# Altium project mantarray_beta2_sensor.PrjPcb
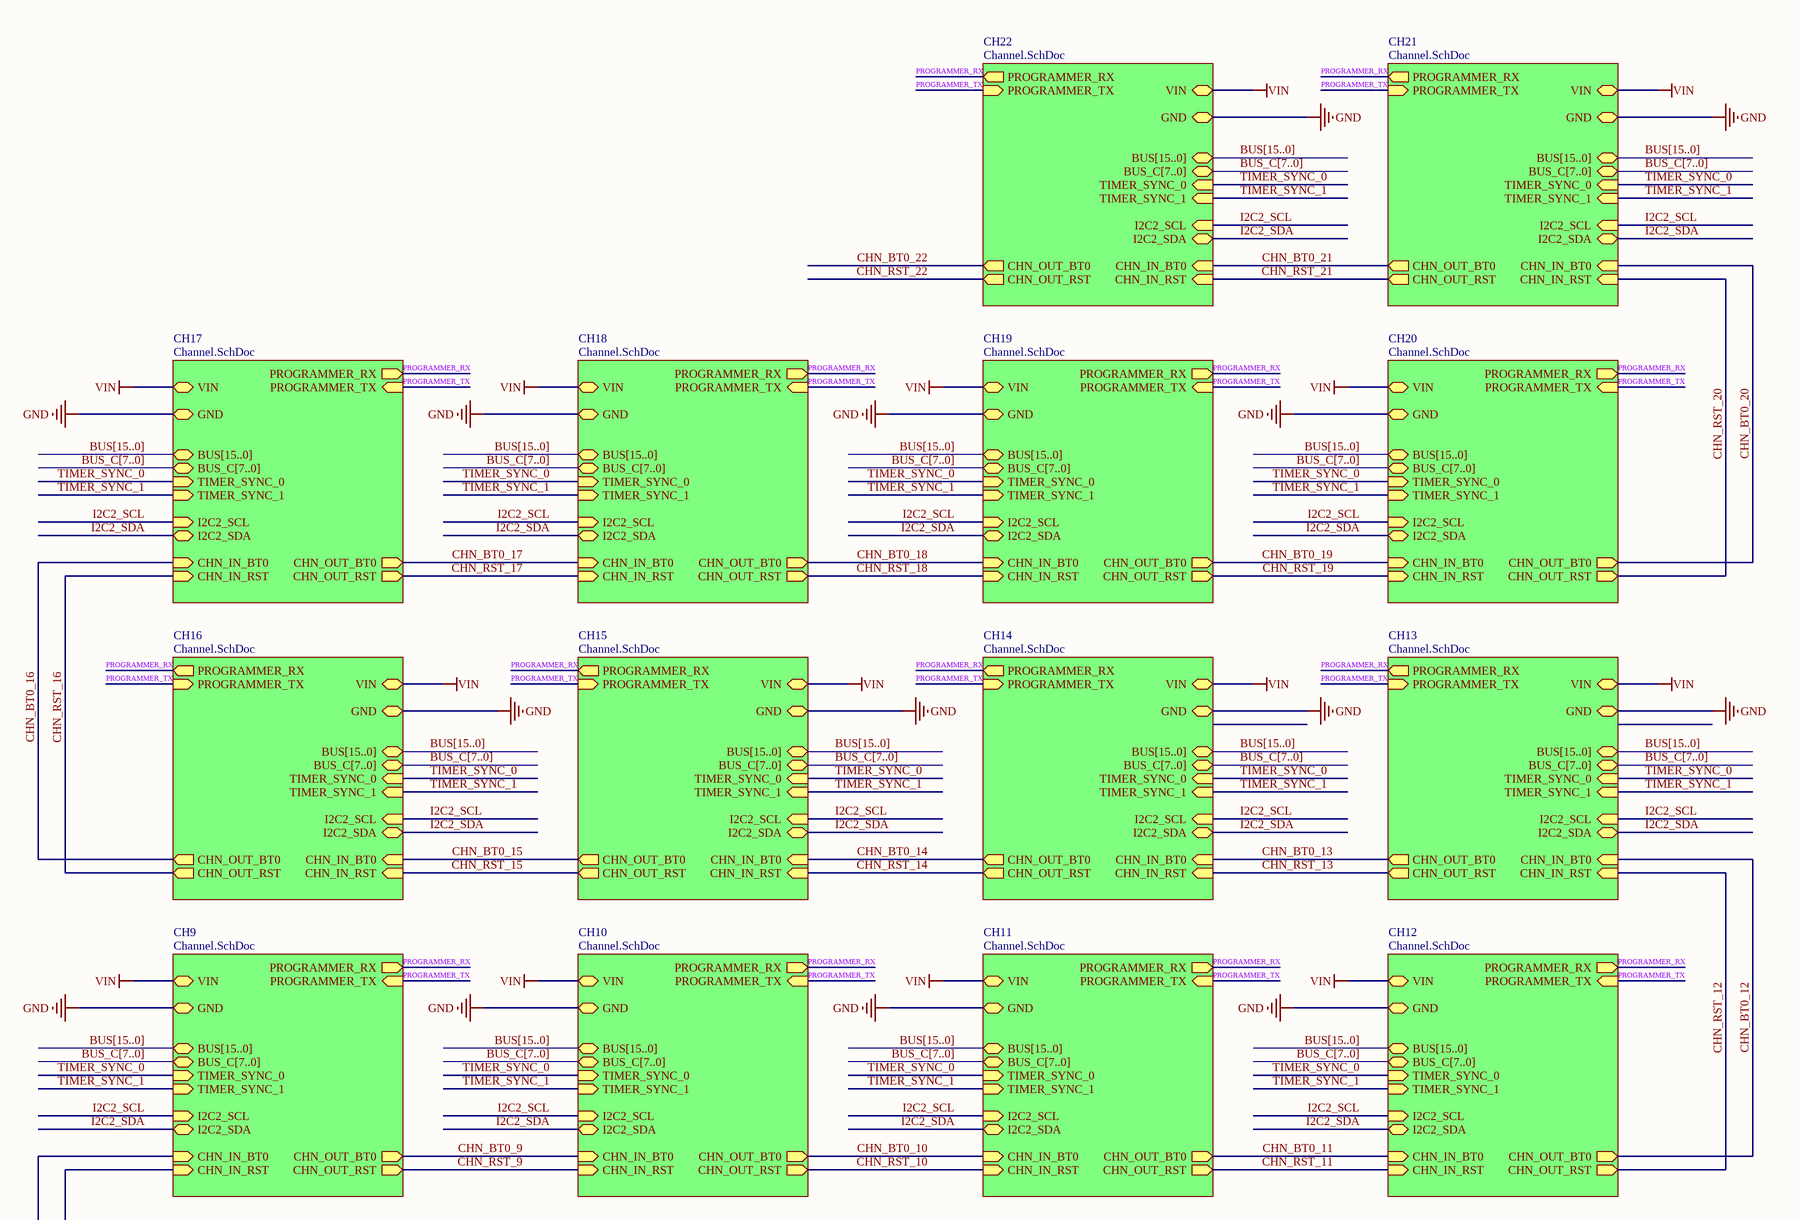
[diagram p0: mantarray_beta2_sensor.SchDoc, top right]
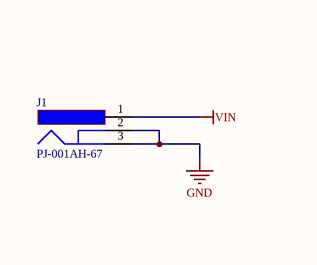
[diagram p1: mantarray_beta2_sensor.SchDoc, bottom left]
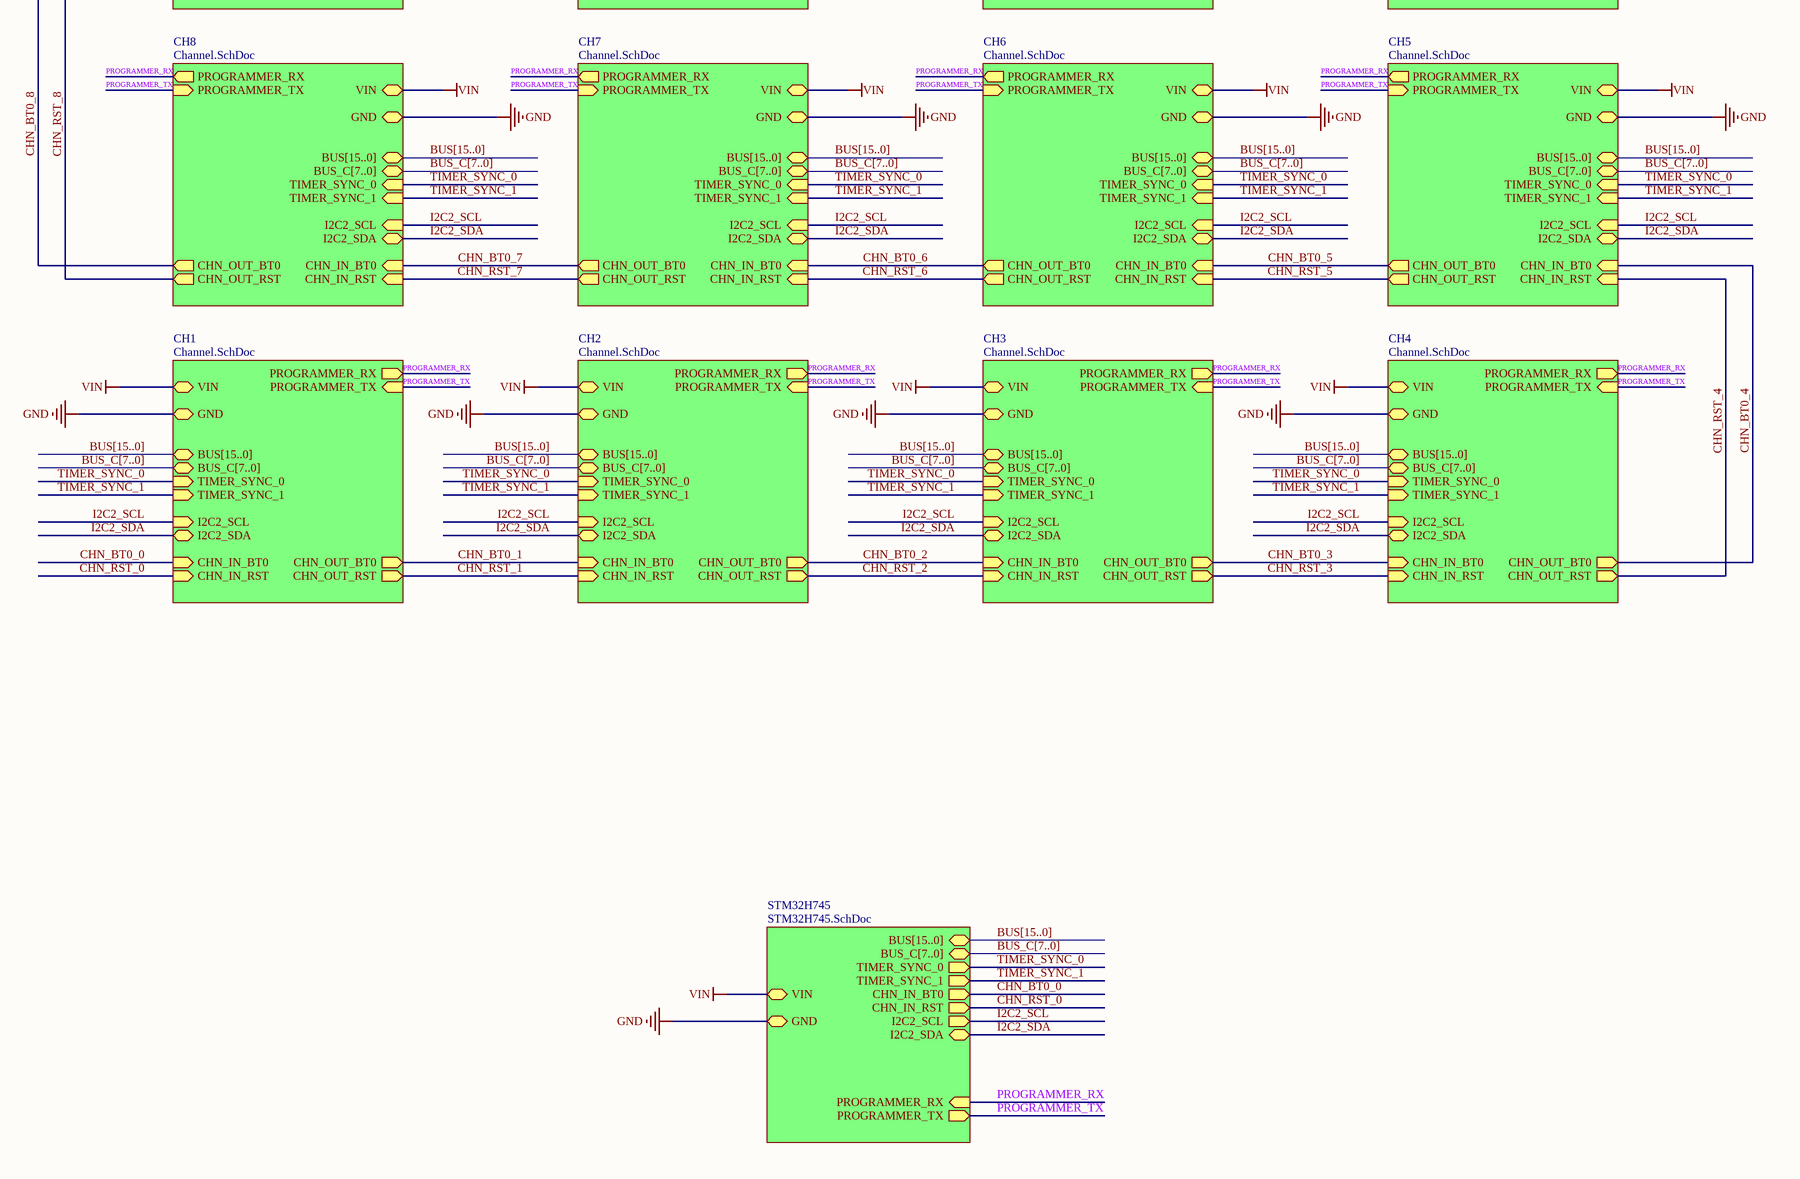
[diagram p2: mantarray_beta2_sensor.SchDoc, bottom right]
3 sheets, 47 parts. Net scope: hierarchical (ports join the sheet entries above them; power ports are global).
Board file: mantarray_beta2_sensor_arrayed.PcbDoc
Sheets:
  mantarray_beta2_sensor.SchDoc
    STM32H745 = STM32H745.SchDoc
    CH1 = Channel.SchDoc
    CH2 = Channel.SchDoc
    CH3 = Channel.SchDoc
    CH4 = Channel.SchDoc
    CH5 = Channel.SchDoc
    CH6 = Channel.SchDoc
    CH7 = Channel.SchDoc
    CH8 = Channel.SchDoc
    CH9 = Channel.SchDoc
    CH10 = Channel.SchDoc
    CH11 = Channel.SchDoc
    CH12 = Channel.SchDoc
    CH13 = Channel.SchDoc
    CH14 = Channel.SchDoc
    CH15 = Channel.SchDoc
    CH16 = Channel.SchDoc
    CH17 = Channel.SchDoc
    CH18 = Channel.SchDoc
    CH19 = Channel.SchDoc
    CH20 = Channel.SchDoc
    CH21 = Channel.SchDoc
    CH22 = Channel.SchDoc

## Sheet mantarray_beta2_sensor.SchDoc
size A1

### Parts
J1  PJ-001AH-67  [PJ-001AH-67]

### Sub-sheets
CH1 = Channel.SchDoc: GND (bidir), BUS[15..0] (bidir), CHN_OUT_BT0 (out), CHN_OUT_RST (out), BUS_C[7..0] (bidir), CHN_IN_RST (in), TIMER_SYNC_0 (in), CHN_IN_BT0 (in), TIMER_SYNC_1 (in), I2C2_SCL (in), I2C2_SDA (bidir), PROGRAMMER_RX (out), PROGRAMMER_TX (in), VIN (bidir)
CH2 = Channel.SchDoc: GND (bidir), BUS[15..0] (bidir), CHN_OUT_BT0 (out), CHN_OUT_RST (out), BUS_C[7..0] (bidir), CHN_IN_RST (in), TIMER_SYNC_0 (in), CHN_IN_BT0 (in), TIMER_SYNC_1 (in), I2C2_SCL (in), I2C2_SDA (bidir), PROGRAMMER_RX (out), PROGRAMMER_TX (in), VIN (bidir)
CH3 = Channel.SchDoc: GND (bidir), BUS[15..0] (bidir), CHN_OUT_BT0 (out), CHN_OUT_RST (out), BUS_C[7..0] (bidir), CHN_IN_RST (in), TIMER_SYNC_0 (in), CHN_IN_BT0 (in), TIMER_SYNC_1 (in), I2C2_SCL (in), I2C2_SDA (bidir), PROGRAMMER_RX (out), PROGRAMMER_TX (in), VIN (bidir)
CH4 = Channel.SchDoc: GND (bidir), BUS[15..0] (bidir), CHN_OUT_BT0 (out), CHN_OUT_RST (out), BUS_C[7..0] (bidir), CHN_IN_RST (in), TIMER_SYNC_0 (in), CHN_IN_BT0 (in), TIMER_SYNC_1 (in), I2C2_SCL (in), I2C2_SDA (bidir), PROGRAMMER_RX (out), PROGRAMMER_TX (in), VIN (bidir)
CH5 = Channel.SchDoc: GND (bidir), BUS[15..0] (bidir), CHN_OUT_BT0 (out), CHN_OUT_RST (out), BUS_C[7..0] (bidir), CHN_IN_RST (in), TIMER_SYNC_0 (in), CHN_IN_BT0 (in), TIMER_SYNC_1 (in), I2C2_SCL (in), I2C2_SDA (bidir), PROGRAMMER_TX (in), PROGRAMMER_RX (out), VIN (bidir)
CH6 = Channel.SchDoc: GND (bidir), BUS[15..0] (bidir), CHN_OUT_BT0 (out), CHN_OUT_RST (out), BUS_C[7..0] (bidir), CHN_IN_RST (in), TIMER_SYNC_0 (in), CHN_IN_BT0 (in), TIMER_SYNC_1 (in), I2C2_SCL (in), I2C2_SDA (bidir), PROGRAMMER_RX (out), PROGRAMMER_TX (in), VIN (bidir)
CH7 = Channel.SchDoc: GND (bidir), BUS[15..0] (bidir), CHN_OUT_BT0 (out), CHN_OUT_RST (out), BUS_C[7..0] (bidir), CHN_IN_RST (in), TIMER_SYNC_0 (in), CHN_IN_BT0 (in), TIMER_SYNC_1 (in), I2C2_SCL (in), I2C2_SDA (bidir), PROGRAMMER_RX (out), PROGRAMMER_TX (in), VIN (bidir)
CH8 = Channel.SchDoc: GND (bidir), BUS[15..0] (bidir), CHN_OUT_BT0 (out), CHN_OUT_RST (out), BUS_C[7..0] (bidir), CHN_IN_RST (in), TIMER_SYNC_0 (in), CHN_IN_BT0 (in), TIMER_SYNC_1 (in), I2C2_SCL (in), I2C2_SDA (bidir), PROGRAMMER_RX (out), PROGRAMMER_TX (in), VIN (bidir)
CH9 = Channel.SchDoc: GND (bidir), BUS[15..0] (bidir), CHN_OUT_BT0 (out), CHN_OUT_RST (out), BUS_C[7..0] (bidir), CHN_IN_RST (in), TIMER_SYNC_0 (in), CHN_IN_BT0 (in), TIMER_SYNC_1 (in), I2C2_SCL (in), I2C2_SDA (bidir), PROGRAMMER_RX (out), PROGRAMMER_TX (in), VIN (bidir)
CH10 = Channel.SchDoc: GND (bidir), BUS[15..0] (bidir), CHN_OUT_BT0 (out), CHN_OUT_RST (out), BUS_C[7..0] (bidir), CHN_IN_RST (in), TIMER_SYNC_0 (in), CHN_IN_BT0 (in), TIMER_SYNC_1 (in), I2C2_SCL (in), I2C2_SDA (bidir), PROGRAMMER_TX (in), PROGRAMMER_RX (out), VIN (bidir)
CH11 = Channel.SchDoc: GND (bidir), BUS[15..0] (bidir), CHN_OUT_BT0 (out), CHN_OUT_RST (out), BUS_C[7..0] (bidir), CHN_IN_RST (in), TIMER_SYNC_0 (in), CHN_IN_BT0 (in), TIMER_SYNC_1 (in), I2C2_SCL (in), I2C2_SDA (bidir), PROGRAMMER_RX (out), PROGRAMMER_TX (in), VIN (bidir)
CH12 = Channel.SchDoc: GND (bidir), BUS[15..0] (bidir), CHN_OUT_BT0 (out), CHN_OUT_RST (out), BUS_C[7..0] (bidir), CHN_IN_RST (in), TIMER_SYNC_0 (in), CHN_IN_BT0 (in), TIMER_SYNC_1 (in), I2C2_SCL (in), I2C2_SDA (bidir), PROGRAMMER_TX (in), PROGRAMMER_RX (out), VIN (bidir)
CH13 = Channel.SchDoc: GND (bidir), BUS[15..0] (bidir), CHN_OUT_BT0 (out), CHN_OUT_RST (out), BUS_C[7..0] (bidir), CHN_IN_RST (in), TIMER_SYNC_0 (in), CHN_IN_BT0 (in), TIMER_SYNC_1 (in), I2C2_SCL (in), I2C2_SDA (bidir), PROGRAMMER_RX (out), PROGRAMMER_TX (in), VIN (bidir)
CH14 = Channel.SchDoc: GND (bidir), BUS[15..0] (bidir), CHN_OUT_BT0 (out), CHN_OUT_RST (out), BUS_C[7..0] (bidir), CHN_IN_RST (in), TIMER_SYNC_0 (in), CHN_IN_BT0 (in), TIMER_SYNC_1 (in), I2C2_SCL (in), I2C2_SDA (bidir), PROGRAMMER_RX (out), PROGRAMMER_TX (in), VIN (bidir)
CH15 = Channel.SchDoc: GND (bidir), BUS[15..0] (bidir), CHN_OUT_BT0 (out), CHN_OUT_RST (out), BUS_C[7..0] (bidir), CHN_IN_RST (in), TIMER_SYNC_0 (in), CHN_IN_BT0 (in), TIMER_SYNC_1 (in), I2C2_SCL (in), I2C2_SDA (bidir), PROGRAMMER_RX (out), PROGRAMMER_TX (in), VIN (bidir)
CH16 = Channel.SchDoc: GND (bidir), BUS[15..0] (bidir), CHN_OUT_BT0 (out), CHN_OUT_RST (out), BUS_C[7..0] (bidir), CHN_IN_RST (in), TIMER_SYNC_0 (in), CHN_IN_BT0 (in), TIMER_SYNC_1 (in), I2C2_SCL (in), I2C2_SDA (bidir), PROGRAMMER_TX (in), PROGRAMMER_RX (out), VIN (bidir)
CH17 = Channel.SchDoc: GND (bidir), BUS[15..0] (bidir), CHN_OUT_BT0 (out), CHN_OUT_RST (out), BUS_C[7..0] (bidir), CHN_IN_RST (in), TIMER_SYNC_0 (in), CHN_IN_BT0 (in), TIMER_SYNC_1 (in), I2C2_SCL (in), I2C2_SDA (bidir), PROGRAMMER_TX (in), PROGRAMMER_RX (out), VIN (bidir)
CH18 = Channel.SchDoc: GND (bidir), BUS[15..0] (bidir), CHN_OUT_BT0 (out), CHN_OUT_RST (out), BUS_C[7..0] (bidir), CHN_IN_RST (in), TIMER_SYNC_0 (in), CHN_IN_BT0 (in), TIMER_SYNC_1 (in), I2C2_SCL (in), I2C2_SDA (bidir), PROGRAMMER_RX (out), PROGRAMMER_TX (in), VIN (bidir)
CH19 = Channel.SchDoc: GND (bidir), BUS[15..0] (bidir), CHN_OUT_BT0 (out), CHN_OUT_RST (out), BUS_C[7..0] (bidir), CHN_IN_RST (in), TIMER_SYNC_0 (in), CHN_IN_BT0 (in), TIMER_SYNC_1 (in), I2C2_SCL (in), I2C2_SDA (bidir), PROGRAMMER_TX (in), PROGRAMMER_RX (out), VIN (bidir)
CH20 = Channel.SchDoc: GND (bidir), BUS[15..0] (bidir), CHN_OUT_BT0 (out), CHN_OUT_RST (out), BUS_C[7..0] (bidir), CHN_IN_RST (in), TIMER_SYNC_0 (in), CHN_IN_BT0 (in), TIMER_SYNC_1 (in), I2C2_SCL (in), I2C2_SDA (bidir), PROGRAMMER_RX (out), PROGRAMMER_TX (in), VIN (bidir)
CH21 = Channel.SchDoc: GND (bidir), BUS[15..0] (bidir), CHN_OUT_BT0 (out), CHN_OUT_RST (out), BUS_C[7..0] (bidir), CHN_IN_RST (in), TIMER_SYNC_0 (in), CHN_IN_BT0 (in), TIMER_SYNC_1 (in), I2C2_SCL (in), I2C2_SDA (bidir), PROGRAMMER_TX (in), PROGRAMMER_RX (out), VIN (bidir)
CH22 = Channel.SchDoc: GND (bidir), BUS[15..0] (bidir), CHN_OUT_BT0 (out), CHN_OUT_RST (out), BUS_C[7..0] (bidir), CHN_IN_RST (in), TIMER_SYNC_0 (in), CHN_IN_BT0 (in), TIMER_SYNC_1 (in), I2C2_SCL (in), I2C2_SDA (bidir), PROGRAMMER_TX (in), PROGRAMMER_RX (out), VIN (bidir)
STM32H745 = STM32H745.SchDoc: GND (bidir), VIN (bidir), BUS[15..0] (bidir), BUS_C[7..0] (bidir), TIMER_SYNC_0 (out), I2C2_SDA (bidir), I2C2_SCL (out), TIMER_SYNC_1 (out), CHN_IN_BT0 (out), CHN_IN_RST (out), PROGRAMMER_RX (in), PROGRAMMER_TX (out)

### Nets
GND: J1.2 J1.3 ; sheet STM32H745/GND, sheet CH1/GND, sheet CH2/GND, sheet CH3/GND, sheet CH4/GND, sheet CH5/GND, sheet CH6/GND, sheet CH7/GND, sheet CH8/GND, sheet CH9/GND, sheet CH10/GND, sheet CH11/GND, sheet CH12/GND, sheet CH13/GND, sheet CH14/GND, sheet CH15/GND, sheet CH16/GND, sheet CH17/GND, sheet CH18/GND, sheet CH19/GND, sheet CH20/GND, sheet CH21/GND, sheet CH22/GND
VIN: J1.1 ; sheet STM32H745/VIN, sheet CH1/VIN, sheet CH2/VIN, sheet CH3/VIN, sheet CH4/VIN, sheet CH5/VIN, sheet CH6/VIN, sheet CH7/VIN, sheet CH8/VIN, sheet CH9/VIN, sheet CH10/VIN, sheet CH11/VIN, sheet CH12/VIN, sheet CH13/VIN, sheet CH14/VIN, sheet CH15/VIN, sheet CH16/VIN, sheet CH17/VIN, sheet CH18/VIN, sheet CH19/VIN, sheet CH20/VIN, sheet CH21/VIN, sheet CH22/VIN
CHN_BT0_0: sheet STM32H745/CHN_IN_BT0, sheet CH1/CHN_IN_BT0
CHN_BT0_1: sheet CH1/CHN_OUT_BT0, sheet CH2/CHN_IN_BT0
CHN_BT0_2: sheet CH2/CHN_OUT_BT0, sheet CH3/CHN_IN_BT0
CHN_BT0_3: sheet CH3/CHN_OUT_BT0, sheet CH4/CHN_IN_BT0
CHN_BT0_4: sheet CH4/CHN_OUT_BT0, sheet CH5/CHN_IN_BT0
CHN_BT0_5: sheet CH5/CHN_OUT_BT0, sheet CH6/CHN_IN_BT0
CHN_BT0_6: sheet CH6/CHN_OUT_BT0, sheet CH7/CHN_IN_BT0
CHN_BT0_7: sheet CH7/CHN_OUT_BT0, sheet CH8/CHN_IN_BT0
CHN_BT0_8: sheet CH8/CHN_OUT_BT0, sheet CH9/CHN_IN_BT0
CHN_BT0_9: sheet CH9/CHN_OUT_BT0, sheet CH10/CHN_IN_BT0
CHN_BT0_10: sheet CH10/CHN_OUT_BT0, sheet CH11/CHN_IN_BT0
CHN_BT0_11: sheet CH11/CHN_OUT_BT0, sheet CH12/CHN_IN_BT0
CHN_BT0_12: sheet CH12/CHN_OUT_BT0, sheet CH13/CHN_IN_BT0
CHN_BT0_13: sheet CH13/CHN_OUT_BT0, sheet CH14/CHN_IN_BT0
CHN_BT0_14: sheet CH14/CHN_OUT_BT0, sheet CH15/CHN_IN_BT0
CHN_BT0_15: sheet CH15/CHN_OUT_BT0, sheet CH16/CHN_IN_BT0
CHN_BT0_16: sheet CH16/CHN_OUT_BT0, sheet CH17/CHN_IN_BT0
CHN_BT0_17: sheet CH17/CHN_OUT_BT0, sheet CH18/CHN_IN_BT0
CHN_BT0_18: sheet CH18/CHN_OUT_BT0, sheet CH19/CHN_IN_BT0
CHN_BT0_19: sheet CH19/CHN_OUT_BT0, sheet CH20/CHN_IN_BT0
CHN_BT0_20: sheet CH20/CHN_OUT_BT0, sheet CH21/CHN_IN_BT0
CHN_BT0_21: sheet CH21/CHN_OUT_BT0, sheet CH22/CHN_IN_BT0
CHN_RST_0: sheet STM32H745/CHN_IN_RST, sheet CH1/CHN_IN_RST  [project net CHN_IN_RST]
CHN_RST_1: sheet CH1/CHN_OUT_RST, sheet CH2/CHN_IN_RST  [project net CHN_IN_RST_CH2]
CHN_RST_2: sheet CH2/CHN_OUT_RST, sheet CH3/CHN_IN_RST  [project net CHN_IN_RST_CH3]
CHN_RST_3: sheet CH3/CHN_OUT_RST, sheet CH4/CHN_IN_RST  [project net CHN_IN_RST_CH4]
CHN_RST_4: sheet CH4/CHN_OUT_RST, sheet CH5/CHN_IN_RST  [project net CHN_IN_RST_CH5]
CHN_RST_5: sheet CH5/CHN_OUT_RST, sheet CH6/CHN_IN_RST  [project net CHN_IN_RST_CH6]
CHN_RST_6: sheet CH6/CHN_OUT_RST, sheet CH7/CHN_IN_RST  [project net CHN_IN_RST_CH7]
CHN_RST_7: sheet CH7/CHN_OUT_RST, sheet CH8/CHN_IN_RST  [project net CHN_IN_RST_CH8]
CHN_RST_8: sheet CH8/CHN_OUT_RST, sheet CH9/CHN_IN_RST  [project net CHN_IN_RST_CH9]
CHN_RST_9: sheet CH9/CHN_OUT_RST, sheet CH10/CHN_IN_RST  [project net CHN_IN_RST_CH10]
CHN_RST_10: sheet CH10/CHN_OUT_RST, sheet CH11/CHN_IN_RST  [project net CHN_IN_RST_CH11]
CHN_RST_11: sheet CH11/CHN_OUT_RST, sheet CH12/CHN_IN_RST  [project net CHN_IN_RST_CH12]
CHN_RST_12: sheet CH12/CHN_OUT_RST, sheet CH13/CHN_IN_RST  [project net CHN_IN_RST_CH13]
CHN_RST_13: sheet CH13/CHN_OUT_RST, sheet CH14/CHN_IN_RST  [project net CHN_IN_RST_CH14]
CHN_RST_14: sheet CH14/CHN_OUT_RST, sheet CH15/CHN_IN_RST  [project net CHN_IN_RST_CH15]
CHN_RST_15: sheet CH15/CHN_OUT_RST, sheet CH16/CHN_IN_RST  [project net CHN_IN_RST_CH16]
CHN_RST_16: sheet CH16/CHN_OUT_RST, sheet CH17/CHN_IN_RST  [project net CHN_IN_RST_CH17]
CHN_RST_17: sheet CH17/CHN_OUT_RST, sheet CH18/CHN_IN_RST  [project net CHN_IN_RST_CH18]
CHN_RST_18: sheet CH18/CHN_OUT_RST, sheet CH19/CHN_IN_RST  [project net CHN_IN_RST_CH19]
CHN_RST_19: sheet CH19/CHN_OUT_RST, sheet CH20/CHN_IN_RST  [project net CHN_IN_RST_CH20]
CHN_RST_20: sheet CH20/CHN_OUT_RST, sheet CH21/CHN_IN_RST  [project net CHN_IN_RST_CH21]
CHN_RST_21: sheet CH21/CHN_OUT_RST, sheet CH22/CHN_IN_RST  [project net CHN_IN_RST_CH22]
CHN_RST_22: sheet CH22/CHN_OUT_RST  [project net CHN_OUT_RST_CH22]
I2C2_SCL: sheet STM32H745/I2C2_SCL, sheet CH1/I2C2_SCL, sheet CH2/I2C2_SCL, sheet CH3/I2C2_SCL, sheet CH4/I2C2_SCL, sheet CH5/I2C2_SCL, sheet CH6/I2C2_SCL, sheet CH7/I2C2_SCL, sheet CH8/I2C2_SCL, sheet CH9/I2C2_SCL, sheet CH10/I2C2_SCL, sheet CH11/I2C2_SCL, sheet CH12/I2C2_SCL, sheet CH13/I2C2_SCL, sheet CH14/I2C2_SCL, sheet CH15/I2C2_SCL, sheet CH16/I2C2_SCL, sheet CH17/I2C2_SCL, sheet CH18/I2C2_SCL, sheet CH19/I2C2_SCL, sheet CH20/I2C2_SCL, sheet CH21/I2C2_SCL, sheet CH22/I2C2_SCL
I2C2_SDA: sheet STM32H745/I2C2_SDA, sheet CH1/I2C2_SDA, sheet CH2/I2C2_SDA, sheet CH3/I2C2_SDA, sheet CH4/I2C2_SDA, sheet CH5/I2C2_SDA, sheet CH6/I2C2_SDA, sheet CH7/I2C2_SDA, sheet CH8/I2C2_SDA, sheet CH9/I2C2_SDA, sheet CH10/I2C2_SDA, sheet CH11/I2C2_SDA, sheet CH12/I2C2_SDA, sheet CH13/I2C2_SDA, sheet CH14/I2C2_SDA, sheet CH15/I2C2_SDA, sheet CH16/I2C2_SDA, sheet CH17/I2C2_SDA, sheet CH18/I2C2_SDA, sheet CH19/I2C2_SDA, sheet CH20/I2C2_SDA, sheet CH21/I2C2_SDA, sheet CH22/I2C2_SDA
PROGRAMMER_RX: sheet STM32H745/PROGRAMMER_RX, sheet CH1/PROGRAMMER_RX, sheet CH2/PROGRAMMER_RX, sheet CH3/PROGRAMMER_RX, sheet CH4/PROGRAMMER_RX, sheet CH5/PROGRAMMER_RX, sheet CH6/PROGRAMMER_RX, sheet CH7/PROGRAMMER_RX, sheet CH8/PROGRAMMER_RX, sheet CH9/PROGRAMMER_RX, sheet CH10/PROGRAMMER_RX, sheet CH11/PROGRAMMER_RX, sheet CH12/PROGRAMMER_RX, sheet CH13/PROGRAMMER_RX, sheet CH14/PROGRAMMER_RX, sheet CH15/PROGRAMMER_RX, sheet CH16/PROGRAMMER_RX, sheet CH17/PROGRAMMER_RX, sheet CH18/PROGRAMMER_RX, sheet CH19/PROGRAMMER_RX, sheet CH20/PROGRAMMER_RX, sheet CH21/PROGRAMMER_RX, sheet CH22/PROGRAMMER_RX
PROGRAMMER_TX: sheet STM32H745/PROGRAMMER_TX, sheet CH1/PROGRAMMER_TX, sheet CH2/PROGRAMMER_TX, sheet CH3/PROGRAMMER_TX, sheet CH4/PROGRAMMER_TX, sheet CH5/PROGRAMMER_TX, sheet CH6/PROGRAMMER_TX, sheet CH7/PROGRAMMER_TX, sheet CH8/PROGRAMMER_TX, sheet CH9/PROGRAMMER_TX, sheet CH10/PROGRAMMER_TX, sheet CH11/PROGRAMMER_TX, sheet CH12/PROGRAMMER_TX, sheet CH13/PROGRAMMER_TX, sheet CH14/PROGRAMMER_TX, sheet CH15/PROGRAMMER_TX, sheet CH16/PROGRAMMER_TX, sheet CH17/PROGRAMMER_TX, sheet CH18/PROGRAMMER_TX, sheet CH19/PROGRAMMER_TX, sheet CH20/PROGRAMMER_TX, sheet CH21/PROGRAMMER_TX, sheet CH22/PROGRAMMER_TX
TIMER_SYNC_0: sheet STM32H745/TIMER_SYNC_0, sheet CH1/TIMER_SYNC_0, sheet CH2/TIMER_SYNC_0, sheet CH3/TIMER_SYNC_0, sheet CH4/TIMER_SYNC_0, sheet CH5/TIMER_SYNC_0, sheet CH6/TIMER_SYNC_0, sheet CH7/TIMER_SYNC_0, sheet CH8/TIMER_SYNC_0, sheet CH9/TIMER_SYNC_0, sheet CH10/TIMER_SYNC_0, sheet CH11/TIMER_SYNC_0, sheet CH12/TIMER_SYNC_0, sheet CH13/TIMER_SYNC_0, sheet CH14/TIMER_SYNC_0, sheet CH15/TIMER_SYNC_0, sheet CH16/TIMER_SYNC_0, sheet CH17/TIMER_SYNC_0, sheet CH18/TIMER_SYNC_0, sheet CH19/TIMER_SYNC_0, sheet CH20/TIMER_SYNC_0, sheet CH21/TIMER_SYNC_0, sheet CH22/TIMER_SYNC_0
TIMER_SYNC_1: sheet STM32H745/TIMER_SYNC_1, sheet CH1/TIMER_SYNC_1, sheet CH2/TIMER_SYNC_1, sheet CH3/TIMER_SYNC_1, sheet CH4/TIMER_SYNC_1, sheet CH5/TIMER_SYNC_1, sheet CH6/TIMER_SYNC_1, sheet CH7/TIMER_SYNC_1, sheet CH8/TIMER_SYNC_1, sheet CH9/TIMER_SYNC_1, sheet CH10/TIMER_SYNC_1, sheet CH11/TIMER_SYNC_1, sheet CH12/TIMER_SYNC_1, sheet CH13/TIMER_SYNC_1, sheet CH14/TIMER_SYNC_1, sheet CH15/TIMER_SYNC_1, sheet CH16/TIMER_SYNC_1, sheet CH17/TIMER_SYNC_1, sheet CH18/TIMER_SYNC_1, sheet CH19/TIMER_SYNC_1, sheet CH20/TIMER_SYNC_1, sheet CH21/TIMER_SYNC_1, sheet CH22/TIMER_SYNC_1

### Buses and harness runs
bus BUS[15..0] = sheet CH1/BUS[15..0]
bus BUS[15..0] = sheet CH2/BUS[15..0]
bus BUS[15..0] = sheet CH3/BUS[15..0]
bus BUS[15..0] = sheet CH4/BUS[15..0]
bus BUS[15..0] = sheet CH5/BUS[15..0]
bus BUS[15..0] = sheet CH6/BUS[15..0]
bus BUS[15..0] = sheet CH7/BUS[15..0]
bus BUS[15..0] = sheet CH8/BUS[15..0]
bus BUS[15..0] = sheet CH9/BUS[15..0]
bus BUS[15..0] = sheet CH10/BUS[15..0]
bus BUS[15..0] = sheet CH11/BUS[15..0]
bus BUS[15..0] = sheet CH12/BUS[15..0]
bus BUS[15..0] = sheet CH13/BUS[15..0]
bus BUS[15..0] = sheet CH14/BUS[15..0]
bus BUS[15..0] = sheet CH15/BUS[15..0]
bus BUS[15..0] = sheet CH16/BUS[15..0]
bus BUS[15..0] = sheet CH17/BUS[15..0]
bus BUS[15..0] = sheet CH18/BUS[15..0]
bus BUS[15..0] = sheet CH19/BUS[15..0]
bus BUS[15..0] = sheet CH20/BUS[15..0]
bus BUS[15..0] = sheet CH21/BUS[15..0]
bus BUS[15..0] = sheet CH22/BUS[15..0]
bus BUS[15..0] = sheet STM32H745/BUS[15..0]
bus BUS_C[7..0] = sheet CH1/BUS_C[7..0]
bus BUS_C[7..0] = sheet CH2/BUS_C[7..0]
bus BUS_C[7..0] = sheet CH3/BUS_C[7..0]
bus BUS_C[7..0] = sheet CH4/BUS_C[7..0]
bus BUS_C[7..0] = sheet CH5/BUS_C[7..0]
bus BUS_C[7..0] = sheet CH6/BUS_C[7..0]
bus BUS_C[7..0] = sheet CH7/BUS_C[7..0]
bus BUS_C[7..0] = sheet CH8/BUS_C[7..0]
bus BUS_C[7..0] = sheet CH9/BUS_C[7..0]
bus BUS_C[7..0] = sheet CH10/BUS_C[7..0]
bus BUS_C[7..0] = sheet CH11/BUS_C[7..0]
bus BUS_C[7..0] = sheet CH12/BUS_C[7..0]
bus BUS_C[7..0] = sheet CH13/BUS_C[7..0]
bus BUS_C[7..0] = sheet CH14/BUS_C[7..0]
bus BUS_C[7..0] = sheet CH15/BUS_C[7..0]
bus BUS_C[7..0] = sheet CH16/BUS_C[7..0]
bus BUS_C[7..0] = sheet CH17/BUS_C[7..0]
bus BUS_C[7..0] = sheet CH18/BUS_C[7..0]
bus BUS_C[7..0] = sheet CH19/BUS_C[7..0]
bus BUS_C[7..0] = sheet CH20/BUS_C[7..0]
bus BUS_C[7..0] = sheet CH21/BUS_C[7..0]
bus BUS_C[7..0] = sheet CH22/BUS_C[7..0]
bus BUS_C[7..0] = sheet STM32H745/BUS_C[7..0]

### Notes on the sheet
- Title
- Size:
- Date:
- File:
- A1
- Number:
- Time:
- Revision:
- Sheet
- of

### Library data of the parts
J1 = PJ-001AH-67: IP67 waterproof DC Power Jack; Digikey: https://www.digikey.com/en/products/detail/cui-devices/PJ-001AH-67/9866231?s=N4IgTCBcDaIAoCkC0AGFBGAggCSQNgHYQBdAXyA

## Sheet STM32H745.SchDoc
size A
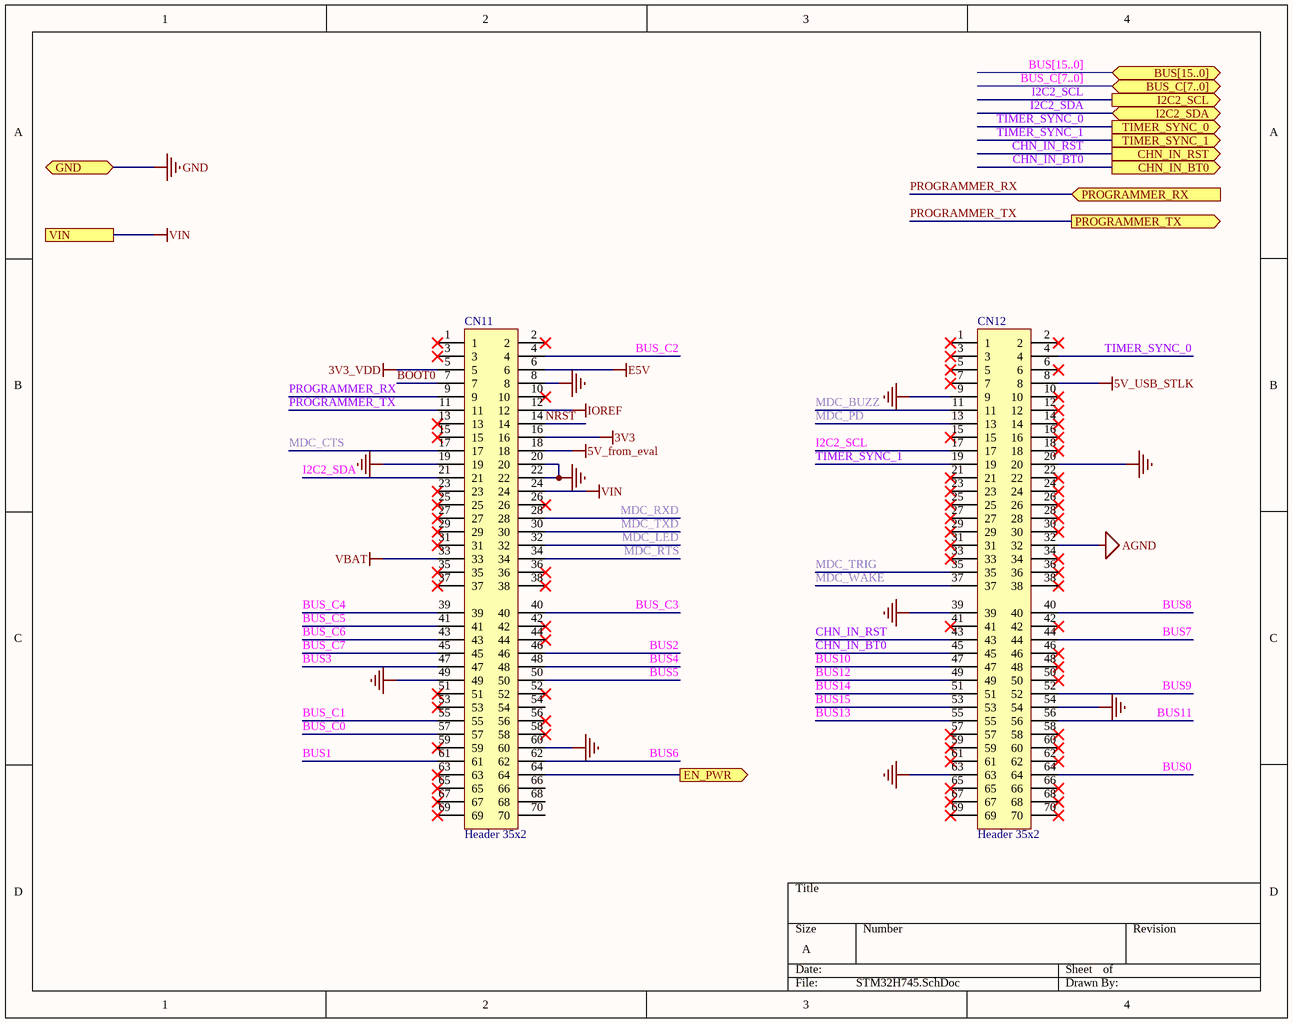
[diagram p3: STM32H745.SchDoc]

### Parts
CN11  Header 35x2  [HDR_2x36_2R54_V_M]
CN12  Header 35x2  [HDR_2x36_2R54_V_M]

### Ports
BUS[15..0] (bidir), BUS_C[7..0] (bidir), CHN_IN_BT0 (out), CHN_IN_RST (out), EN_PWR (out), GND (bidir), I2C2_SCL (out), I2C2_SDA (bidir), PROGRAMMER_RX (in), PROGRAMMER_TX (out), TIMER_SYNC_0 (out), TIMER_SYNC_1 (out), VIN

### Nets
3V3: CN11.16
3V3_VDD: CN11.5
5V_from_eval: CN11.18
5V_USB_STLK: CN12.8
AGND: CN12.32
E5V: CN11.6
GND: CN11.8 CN11.19 CN11.20 CN11.22 CN11.49 CN11.60 CN12.9 CN12.20 CN12.39 CN12.54 CN12.63 ; port GND
IOREF: CN11.12
VBAT: CN11.33
VIN: CN11.24 ; port VIN
BOOT0: CN11.7
BUS0: CN12.64
BUS1: CN11.61
BUS2: CN11.46
BUS3: CN11.47
BUS4: CN11.48
BUS5: CN11.50
BUS6: CN11.62
BUS7: CN12.44
BUS8: CN12.40
BUS9: CN12.52
BUS10: CN12.47
BUS11: CN12.56
BUS12: CN12.49
BUS13: CN12.55
BUS14: CN12.51
BUS15: CN12.53
BUS_C0: CN11.57
BUS_C1: CN11.55
BUS_C2: CN11.4
BUS_C3: CN11.40
BUS_C4: CN11.39
BUS_C5: CN11.41
BUS_C6: CN11.43
BUS_C7: CN11.45
CHN_IN_BT0: CN12.45 ; port CHN_IN_BT0  [project net CHN_BT0_0]
CHN_IN_RST: CN12.43 ; port CHN_IN_RST
I2C2_SCL: CN12.17 ; port I2C2_SCL
I2C2_SDA: CN11.21 ; port I2C2_SDA
MDC_BUZZ: CN12.11
MDC_CTS: CN11.17
MDC_LED: CN11.32
MDC_PD: CN12.13
MDC_RTS: CN11.34
MDC_RXD: CN11.28
MDC_TRIG: CN12.35
MDC_TXD: CN11.30
MDC_WAKE: CN12.37
NRST: CN11.14
PROGRAMMER_RX: CN11.9 ; port PROGRAMMER_RX
PROGRAMMER_TX: CN11.11 ; port PROGRAMMER_TX
TIMER_SYNC_0: CN12.4 ; port TIMER_SYNC_0
TIMER_SYNC_1: CN12.19 ; port TIMER_SYNC_1
NetCN11_64: CN11.64 ; port EN_PWR

Not connected (* = marked no-connect by the designer): CN11 1* 2* 3* 10* 13* 15* 23* 25* 26* 27* 29* 31* 35* 36* 37* 38* 42* 44* 51* 52* 53* 54 56* 58* 59* 63* 65* 66 67* 68 69* 70; CN12 1* 2* 3* 5* 6* 7* 10* 12* 14* 15* 16* 18* 21* 22* 23* 24* 25* 26* 27* 28* 29* 30* 31* 33* 34* 36* 38* 41* 42* 46* 48* 50* 57* 58* 59* 60* 61* 62* 65* 66* 67* 68* 69* 70*

### Buses and harness runs
bus BUS[15..0] = port BUS[15..0]
bus BUS_C[7..0] = port BUS_C[7..0]

### Library data of the parts
CN11 CN12 = MCD-01210: Header, 35x2, 2,54mm, VR, TH, Height 5.84mm/2.54mm; Parameter 1: 929975E-01-36-ND; ComponentLink1Description: digikey; ComponentLink1URL: https://www.digikey.com/en/products/detail/929975-01-36-RK/929975E-01-36-ND/1094325?itemSeq=354777972

## Sheet Channel.SchDoc
size A3
Used 22 times, as channels CH1, CH2, CH3, CH4, CH5, CH6, CH7, CH8, CH9, CH10, CH11, CH12, CH13, CH14, CH15, CH16, CH17, CH18, CH19, CH20, CH21, CH22. Parts and nets are listed once, with the designators drawn on the sheet.
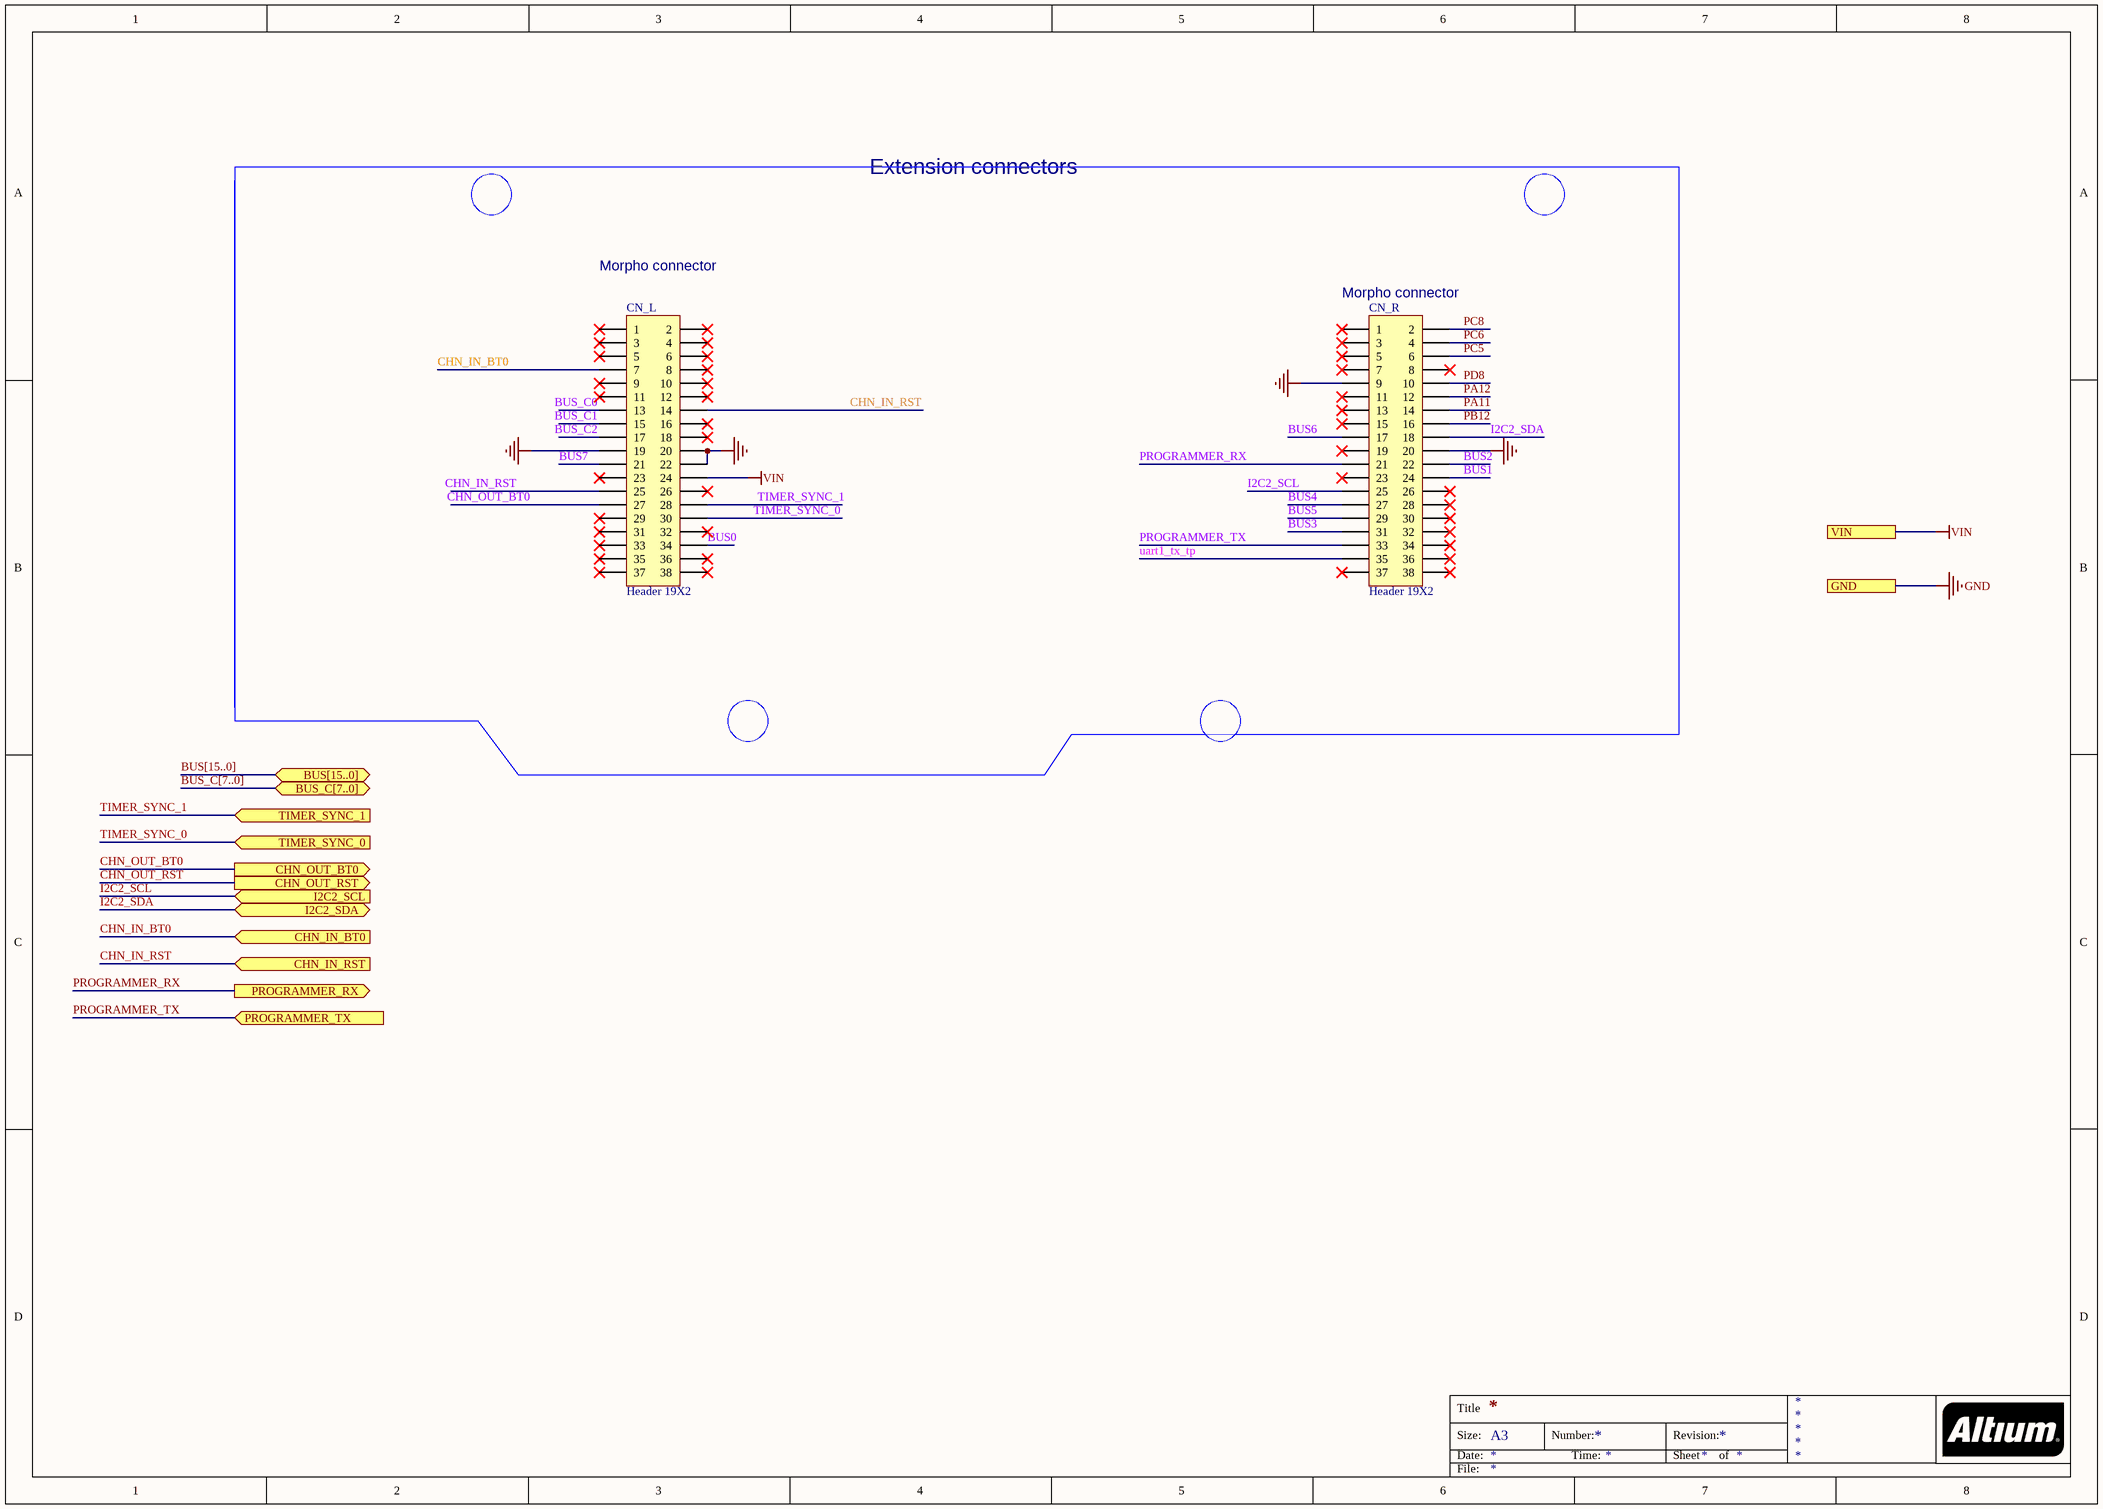
[diagram p4: Channel.SchDoc]

### Parts
CN_L  Header 19X2  [HDR2X19]
CN_R  Header 19X2  [HDR2X19]

### Blocks framed on the sheet
Extension connectors: CN_L CN_R

### Ports
BUS[15..0] (bidir), BUS_C[7..0] (bidir), CHN_IN_BT0 (in), CHN_IN_RST (in), CHN_OUT_BT0 (out), CHN_OUT_RST (out), GND, I2C2_SCL (in), I2C2_SDA (bidir), PROGRAMMER_RX (out), PROGRAMMER_TX (in), TIMER_SYNC_0 (in), TIMER_SYNC_1 (in), VIN

### Nets
GND: CN_L.19 CN_L.20 CN_L.22 CN_R.9 CN_R.20 ; port GND
VIN: CN_L.24 ; port VIN
BUS0: CN_L.34
BUS1: CN_R.24
BUS2: CN_R.22
BUS3: CN_R.31
BUS4: CN_R.27
BUS5: CN_R.29
BUS6: CN_R.17
BUS7: CN_L.21
BUS_C0: CN_L.13
BUS_C1: CN_L.15
BUS_C2: CN_L.17
CHN_IN_BT0: CN_L.7 ; port CHN_IN_BT0
CHN_IN_RST: CN_L.14 CN_L.25 ; port CHN_IN_RST
CHN_OUT_BT0: CN_L.27 ; port CHN_OUT_BT0
CHN_OUT_RST: port CHN_OUT_RST
I2C2_SCL: CN_R.25 ; port I2C2_SCL
I2C2_SDA: CN_R.18 ; port I2C2_SDA
PA11: CN_R.14
PA12: CN_R.12
PB12: CN_R.16
PC5: CN_R.6
PC6: CN_R.4
PC8: CN_R.2
PD8: CN_R.10
PROGRAMMER_RX: CN_R.21 ; port PROGRAMMER_RX
PROGRAMMER_TX: CN_R.33 ; port PROGRAMMER_TX
TIMER_SYNC_0: CN_L.30 ; port TIMER_SYNC_0
TIMER_SYNC_1: CN_L.28 ; port TIMER_SYNC_1
uart1_tx_tp: CN_R.35

Not connected (* = marked no-connect by the designer): CN_L 1* 2* 3* 4* 5* 6* 8* 9* 10* 11* 12* 16* 18* 23* 26* 29* 31* 32* 33* 35* 36* 37* 38*; CN_R 1* 3* 5* 7* 8* 11* 13* 15* 19* 23* 26* 28* 30* 32* 34* 36* 37* 38*

### Channels
CH1: designators end in _CH1; ports CHN_IN_BT0=CHN_BT0_0 CHN_IN_RST=CHN_IN_RST CHN_OUT_BT0=CHN_BT0_1 CHN_OUT_RST=CHN_IN_RST_CH2 GND=GND I2C2_SCL=I2C2_SCL I2C2_SDA=I2C2_SDA PROGRAMMER_RX=PROGRAMMER_RX PROGRAMMER_TX=PROGRAMMER_TX TIMER_SYNC_0=TIMER_SYNC_0 TIMER_SYNC_1=TIMER_SYNC_1 VIN=VIN
CH2: designators end in _CH2; ports CHN_IN_BT0=CHN_BT0_1 CHN_IN_RST=CHN_IN_RST_CH2 CHN_OUT_BT0=CHN_BT0_2 CHN_OUT_RST=CHN_IN_RST_CH3 GND=GND I2C2_SCL=I2C2_SCL I2C2_SDA=I2C2_SDA PROGRAMMER_RX=PROGRAMMER_RX PROGRAMMER_TX=PROGRAMMER_TX TIMER_SYNC_0=TIMER_SYNC_0 TIMER_SYNC_1=TIMER_SYNC_1 VIN=VIN
CH3: designators end in _CH3; ports CHN_IN_BT0=CHN_BT0_2 CHN_IN_RST=CHN_IN_RST_CH3 CHN_OUT_BT0=CHN_BT0_3 CHN_OUT_RST=CHN_IN_RST_CH4 GND=GND I2C2_SCL=I2C2_SCL I2C2_SDA=I2C2_SDA PROGRAMMER_RX=PROGRAMMER_RX PROGRAMMER_TX=PROGRAMMER_TX TIMER_SYNC_0=TIMER_SYNC_0 TIMER_SYNC_1=TIMER_SYNC_1 VIN=VIN
CH4: designators end in _CH4; ports CHN_IN_BT0=CHN_BT0_3 CHN_IN_RST=CHN_IN_RST_CH4 CHN_OUT_BT0=CHN_BT0_4 CHN_OUT_RST=CHN_IN_RST_CH5 GND=GND I2C2_SCL=I2C2_SCL I2C2_SDA=I2C2_SDA PROGRAMMER_RX=PROGRAMMER_RX PROGRAMMER_TX=PROGRAMMER_TX TIMER_SYNC_0=TIMER_SYNC_0 TIMER_SYNC_1=TIMER_SYNC_1 VIN=VIN
CH5: designators end in _CH5; ports CHN_IN_BT0=CHN_BT0_4 CHN_IN_RST=CHN_IN_RST_CH5 CHN_OUT_BT0=CHN_BT0_5 CHN_OUT_RST=CHN_IN_RST_CH6 GND=GND I2C2_SCL=I2C2_SCL I2C2_SDA=I2C2_SDA PROGRAMMER_RX=PROGRAMMER_RX PROGRAMMER_TX=PROGRAMMER_TX TIMER_SYNC_0=TIMER_SYNC_0 TIMER_SYNC_1=TIMER_SYNC_1 VIN=VIN
CH6: designators end in _CH6; ports CHN_IN_BT0=CHN_BT0_5 CHN_IN_RST=CHN_IN_RST_CH6 CHN_OUT_BT0=CHN_BT0_6 CHN_OUT_RST=CHN_IN_RST_CH7 GND=GND I2C2_SCL=I2C2_SCL I2C2_SDA=I2C2_SDA PROGRAMMER_RX=PROGRAMMER_RX PROGRAMMER_TX=PROGRAMMER_TX TIMER_SYNC_0=TIMER_SYNC_0 TIMER_SYNC_1=TIMER_SYNC_1 VIN=VIN
CH7: designators end in _CH7; ports CHN_IN_BT0=CHN_BT0_6 CHN_IN_RST=CHN_IN_RST_CH7 CHN_OUT_BT0=CHN_BT0_7 CHN_OUT_RST=CHN_IN_RST_CH8 GND=GND I2C2_SCL=I2C2_SCL I2C2_SDA=I2C2_SDA PROGRAMMER_RX=PROGRAMMER_RX PROGRAMMER_TX=PROGRAMMER_TX TIMER_SYNC_0=TIMER_SYNC_0 TIMER_SYNC_1=TIMER_SYNC_1 VIN=VIN
CH8: designators end in _CH8; ports CHN_IN_BT0=CHN_BT0_7 CHN_IN_RST=CHN_IN_RST_CH8 CHN_OUT_BT0=CHN_BT0_8 CHN_OUT_RST=CHN_IN_RST_CH9 GND=GND I2C2_SCL=I2C2_SCL I2C2_SDA=I2C2_SDA PROGRAMMER_RX=PROGRAMMER_RX PROGRAMMER_TX=PROGRAMMER_TX TIMER_SYNC_0=TIMER_SYNC_0 TIMER_SYNC_1=TIMER_SYNC_1 VIN=VIN
CH9: designators end in _CH9; ports CHN_IN_BT0=CHN_BT0_8 CHN_IN_RST=CHN_IN_RST_CH9 CHN_OUT_BT0=CHN_BT0_9 CHN_OUT_RST=CHN_IN_RST_CH10 GND=GND I2C2_SCL=I2C2_SCL I2C2_SDA=I2C2_SDA PROGRAMMER_RX=PROGRAMMER_RX PROGRAMMER_TX=PROGRAMMER_TX TIMER_SYNC_0=TIMER_SYNC_0 TIMER_SYNC_1=TIMER_SYNC_1 VIN=VIN
CH10: designators end in _CH10; ports CHN_IN_BT0=CHN_BT0_9 CHN_IN_RST=CHN_IN_RST_CH10 CHN_OUT_BT0=CHN_BT0_10 CHN_OUT_RST=CHN_IN_RST_CH11 GND=GND I2C2_SCL=I2C2_SCL I2C2_SDA=I2C2_SDA PROGRAMMER_RX=PROGRAMMER_RX PROGRAMMER_TX=PROGRAMMER_TX TIMER_SYNC_0=TIMER_SYNC_0 TIMER_SYNC_1=TIMER_SYNC_1 VIN=VIN
CH11: designators end in _CH11; ports CHN_IN_BT0=CHN_BT0_10 CHN_IN_RST=CHN_IN_RST_CH11 CHN_OUT_BT0=CHN_BT0_11 CHN_OUT_RST=CHN_IN_RST_CH12 GND=GND I2C2_SCL=I2C2_SCL I2C2_SDA=I2C2_SDA PROGRAMMER_RX=PROGRAMMER_RX PROGRAMMER_TX=PROGRAMMER_TX TIMER_SYNC_0=TIMER_SYNC_0 TIMER_SYNC_1=TIMER_SYNC_1 VIN=VIN
CH12: designators end in _CH12; ports CHN_IN_BT0=CHN_BT0_11 CHN_IN_RST=CHN_IN_RST_CH12 CHN_OUT_BT0=CHN_BT0_12 CHN_OUT_RST=CHN_IN_RST_CH13 GND=GND I2C2_SCL=I2C2_SCL I2C2_SDA=I2C2_SDA PROGRAMMER_RX=PROGRAMMER_RX PROGRAMMER_TX=PROGRAMMER_TX TIMER_SYNC_0=TIMER_SYNC_0 TIMER_SYNC_1=TIMER_SYNC_1 VIN=VIN
CH13: designators end in _CH13; ports CHN_IN_BT0=CHN_BT0_12 CHN_IN_RST=CHN_IN_RST_CH13 CHN_OUT_BT0=CHN_BT0_13 CHN_OUT_RST=CHN_IN_RST_CH14 GND=GND I2C2_SCL=I2C2_SCL I2C2_SDA=I2C2_SDA PROGRAMMER_RX=PROGRAMMER_RX PROGRAMMER_TX=PROGRAMMER_TX TIMER_SYNC_0=TIMER_SYNC_0 TIMER_SYNC_1=TIMER_SYNC_1 VIN=VIN
CH14: designators end in _CH14; ports CHN_IN_BT0=CHN_BT0_13 CHN_IN_RST=CHN_IN_RST_CH14 CHN_OUT_BT0=CHN_BT0_14 CHN_OUT_RST=CHN_IN_RST_CH15 GND=GND I2C2_SCL=I2C2_SCL I2C2_SDA=I2C2_SDA PROGRAMMER_RX=PROGRAMMER_RX PROGRAMMER_TX=PROGRAMMER_TX TIMER_SYNC_0=TIMER_SYNC_0 TIMER_SYNC_1=TIMER_SYNC_1 VIN=VIN
CH15: designators end in _CH15; ports CHN_IN_BT0=CHN_BT0_14 CHN_IN_RST=CHN_IN_RST_CH15 CHN_OUT_BT0=CHN_BT0_15 CHN_OUT_RST=CHN_IN_RST_CH16 GND=GND I2C2_SCL=I2C2_SCL I2C2_SDA=I2C2_SDA PROGRAMMER_RX=PROGRAMMER_RX PROGRAMMER_TX=PROGRAMMER_TX TIMER_SYNC_0=TIMER_SYNC_0 TIMER_SYNC_1=TIMER_SYNC_1 VIN=VIN
CH16: designators end in _CH16; ports CHN_IN_BT0=CHN_BT0_15 CHN_IN_RST=CHN_IN_RST_CH16 CHN_OUT_BT0=CHN_BT0_16 CHN_OUT_RST=CHN_IN_RST_CH17 GND=GND I2C2_SCL=I2C2_SCL I2C2_SDA=I2C2_SDA PROGRAMMER_RX=PROGRAMMER_RX PROGRAMMER_TX=PROGRAMMER_TX TIMER_SYNC_0=TIMER_SYNC_0 TIMER_SYNC_1=TIMER_SYNC_1 VIN=VIN
CH17: designators end in _CH17; ports CHN_IN_BT0=CHN_BT0_16 CHN_IN_RST=CHN_IN_RST_CH17 CHN_OUT_BT0=CHN_BT0_17 CHN_OUT_RST=CHN_IN_RST_CH18 GND=GND I2C2_SCL=I2C2_SCL I2C2_SDA=I2C2_SDA PROGRAMMER_RX=PROGRAMMER_RX PROGRAMMER_TX=PROGRAMMER_TX TIMER_SYNC_0=TIMER_SYNC_0 TIMER_SYNC_1=TIMER_SYNC_1 VIN=VIN
CH18: designators end in _CH18; ports CHN_IN_BT0=CHN_BT0_17 CHN_IN_RST=CHN_IN_RST_CH18 CHN_OUT_BT0=CHN_BT0_18 CHN_OUT_RST=CHN_IN_RST_CH19 GND=GND I2C2_SCL=I2C2_SCL I2C2_SDA=I2C2_SDA PROGRAMMER_RX=PROGRAMMER_RX PROGRAMMER_TX=PROGRAMMER_TX TIMER_SYNC_0=TIMER_SYNC_0 TIMER_SYNC_1=TIMER_SYNC_1 VIN=VIN
CH19: designators end in _CH19; ports CHN_IN_BT0=CHN_BT0_18 CHN_IN_RST=CHN_IN_RST_CH19 CHN_OUT_BT0=CHN_BT0_19 CHN_OUT_RST=CHN_IN_RST_CH20 GND=GND I2C2_SCL=I2C2_SCL I2C2_SDA=I2C2_SDA PROGRAMMER_RX=PROGRAMMER_RX PROGRAMMER_TX=PROGRAMMER_TX TIMER_SYNC_0=TIMER_SYNC_0 TIMER_SYNC_1=TIMER_SYNC_1 VIN=VIN
CH20: designators end in _CH20; ports CHN_IN_BT0=CHN_BT0_19 CHN_IN_RST=CHN_IN_RST_CH20 CHN_OUT_BT0=CHN_BT0_20 CHN_OUT_RST=CHN_IN_RST_CH21 GND=GND I2C2_SCL=I2C2_SCL I2C2_SDA=I2C2_SDA PROGRAMMER_RX=PROGRAMMER_RX PROGRAMMER_TX=PROGRAMMER_TX TIMER_SYNC_0=TIMER_SYNC_0 TIMER_SYNC_1=TIMER_SYNC_1 VIN=VIN
CH21: designators end in _CH21; ports CHN_IN_BT0=CHN_BT0_20 CHN_IN_RST=CHN_IN_RST_CH21 CHN_OUT_BT0=CHN_BT0_21 CHN_OUT_RST=CHN_IN_RST_CH22 GND=GND I2C2_SCL=I2C2_SCL I2C2_SDA=I2C2_SDA PROGRAMMER_RX=PROGRAMMER_RX PROGRAMMER_TX=PROGRAMMER_TX TIMER_SYNC_0=TIMER_SYNC_0 TIMER_SYNC_1=TIMER_SYNC_1 VIN=VIN
CH22: designators end in _CH22; ports CHN_IN_BT0=CHN_BT0_21 CHN_IN_RST=CHN_IN_RST_CH22 CHN_OUT_BT0=CHN_BT0_22 CHN_OUT_RST=CHN_OUT_RST_CH22 GND=GND I2C2_SCL=I2C2_SCL I2C2_SDA=I2C2_SDA PROGRAMMER_RX=PROGRAMMER_RX PROGRAMMER_TX=PROGRAMMER_TX TIMER_SYNC_0=TIMER_SYNC_0 TIMER_SYNC_1=TIMER_SYNC_1 VIN=VIN

### Buses and harness runs
bus BUS[15..0] = port BUS[15..0]
bus BUS_C[7..0] = port BUS_C[7..0]

### Notes on the sheet
- Morpho connector
- (near CN_R) Morpho connector
- Title
- Size:
- Date:
- A3
- Number:
- Time:
- Revision:
- Sheet
- of
- File:

### Library data of the parts
CN_L CN_R = Header 19X2: Connectors, Interconnects / Rectangular Connectors - Headers, Receptacles, Female Sockets, 19-Hole, Dual row; Revision: 17-Jul-2002: Re-released for DXP Platform.; Publisher: Altium Limited; digikey: https://www.digikey.com/en/products/detail/te-connectivity-amp-connectors/4-1734506-2/4022265

## Nets that join several sheets
GND: mantarray_beta2_sensor (J1.2 J1.3), STM32H745 (11 pins), CH1 (5 pins), CH2 (5 pins), CH3 (5 pins), CH4 (5 pins), CH5 (5 pins), CH6 (5 pins), CH7 (5 pins), CH8 (5 pins), CH9 (5 pins), CH10 (5 pins), CH11 (5 pins), CH12 (5 pins), CH13 (5 pins), CH14 (5 pins), CH15 (5 pins), CH16 (5 pins), CH17 (5 pins), CH18 (5 pins), CH19 (5 pins), CH20 (5 pins), CH21 (5 pins), CH22 (5 pins)
VIN: mantarray_beta2_sensor (J1.1), STM32H745 (CN11.24), CH1 (CN_L_CH1.24), CH2 (CN_L_CH2.24), CH3 (CN_L_CH3.24), CH4 (CN_L_CH4.24), CH5 (CN_L_CH5.24), CH6 (CN_L_CH6.24), CH7 (CN_L_CH7.24), CH8 (CN_L_CH8.24), CH9 (CN_L_CH9.24), CH10 (CN_L_CH10.24), CH11 (CN_L_CH11.24), CH12 (CN_L_CH12.24), CH13 (CN_L_CH13.24), CH14 (CN_L_CH14.24), CH15 (CN_L_CH15.24), CH16 (CN_L_CH16.24), CH17 (CN_L_CH17.24), CH18 (CN_L_CH18.24), CH19 (CN_L_CH19.24), CH20 (CN_L_CH20.24), CH21 (CN_L_CH21.24), CH22 (CN_L_CH22.24)
BUS0: STM32H745 (CN12.64), CH1 (CN_L_CH1.34), CH2 (CN_L_CH2.34), CH3 (CN_L_CH3.34), CH4 (CN_L_CH4.34), CH5 (CN_L_CH5.34), CH6 (CN_L_CH6.34), CH7 (CN_L_CH7.34), CH8 (CN_L_CH8.34), CH9 (CN_L_CH9.34), CH10 (CN_L_CH10.34), CH11 (CN_L_CH11.34), CH12 (CN_L_CH12.34), CH13 (CN_L_CH13.34), CH14 (CN_L_CH14.34), CH15 (CN_L_CH15.34), CH16 (CN_L_CH16.34), CH17 (CN_L_CH17.34), CH18 (CN_L_CH18.34), CH19 (CN_L_CH19.34), CH20 (CN_L_CH20.34), CH21 (CN_L_CH21.34), CH22 (CN_L_CH22.34)
BUS1: STM32H745 (CN11.61), CH1 (CN_R_CH1.24), CH2 (CN_R_CH2.24), CH3 (CN_R_CH3.24), CH4 (CN_R_CH4.24), CH5 (CN_R_CH5.24), CH6 (CN_R_CH6.24), CH7 (CN_R_CH7.24), CH8 (CN_R_CH8.24), CH9 (CN_R_CH9.24), CH10 (CN_R_CH10.24), CH11 (CN_R_CH11.24), CH12 (CN_R_CH12.24), CH13 (CN_R_CH13.24), CH14 (CN_R_CH14.24), CH15 (CN_R_CH15.24), CH16 (CN_R_CH16.24), CH17 (CN_R_CH17.24), CH18 (CN_R_CH18.24), CH19 (CN_R_CH19.24), CH20 (CN_R_CH20.24), CH21 (CN_R_CH21.24), CH22 (CN_R_CH22.24)
BUS2: STM32H745 (CN11.46), CH1 (CN_R_CH1.22), CH2 (CN_R_CH2.22), CH3 (CN_R_CH3.22), CH4 (CN_R_CH4.22), CH5 (CN_R_CH5.22), CH6 (CN_R_CH6.22), CH7 (CN_R_CH7.22), CH8 (CN_R_CH8.22), CH9 (CN_R_CH9.22), CH10 (CN_R_CH10.22), CH11 (CN_R_CH11.22), CH12 (CN_R_CH12.22), CH13 (CN_R_CH13.22), CH14 (CN_R_CH14.22), CH15 (CN_R_CH15.22), CH16 (CN_R_CH16.22), CH17 (CN_R_CH17.22), CH18 (CN_R_CH18.22), CH19 (CN_R_CH19.22), CH20 (CN_R_CH20.22), CH21 (CN_R_CH21.22), CH22 (CN_R_CH22.22)
BUS3: STM32H745 (CN11.47), CH1 (CN_R_CH1.31), CH2 (CN_R_CH2.31), CH3 (CN_R_CH3.31), CH4 (CN_R_CH4.31), CH5 (CN_R_CH5.31), CH6 (CN_R_CH6.31), CH7 (CN_R_CH7.31), CH8 (CN_R_CH8.31), CH9 (CN_R_CH9.31), CH10 (CN_R_CH10.31), CH11 (CN_R_CH11.31), CH12 (CN_R_CH12.31), CH13 (CN_R_CH13.31), CH14 (CN_R_CH14.31), CH15 (CN_R_CH15.31), CH16 (CN_R_CH16.31), CH17 (CN_R_CH17.31), CH18 (CN_R_CH18.31), CH19 (CN_R_CH19.31), CH20 (CN_R_CH20.31), CH21 (CN_R_CH21.31), CH22 (CN_R_CH22.31)
BUS4: STM32H745 (CN11.48), CH1 (CN_R_CH1.27), CH2 (CN_R_CH2.27), CH3 (CN_R_CH3.27), CH4 (CN_R_CH4.27), CH5 (CN_R_CH5.27), CH6 (CN_R_CH6.27), CH7 (CN_R_CH7.27), CH8 (CN_R_CH8.27), CH9 (CN_R_CH9.27), CH10 (CN_R_CH10.27), CH11 (CN_R_CH11.27), CH12 (CN_R_CH12.27), CH13 (CN_R_CH13.27), CH14 (CN_R_CH14.27), CH15 (CN_R_CH15.27), CH16 (CN_R_CH16.27), CH17 (CN_R_CH17.27), CH18 (CN_R_CH18.27), CH19 (CN_R_CH19.27), CH20 (CN_R_CH20.27), CH21 (CN_R_CH21.27), CH22 (CN_R_CH22.27)
BUS5: STM32H745 (CN11.50), CH1 (CN_R_CH1.29), CH2 (CN_R_CH2.29), CH3 (CN_R_CH3.29), CH4 (CN_R_CH4.29), CH5 (CN_R_CH5.29), CH6 (CN_R_CH6.29), CH7 (CN_R_CH7.29), CH8 (CN_R_CH8.29), CH9 (CN_R_CH9.29), CH10 (CN_R_CH10.29), CH11 (CN_R_CH11.29), CH12 (CN_R_CH12.29), CH13 (CN_R_CH13.29), CH14 (CN_R_CH14.29), CH15 (CN_R_CH15.29), CH16 (CN_R_CH16.29), CH17 (CN_R_CH17.29), CH18 (CN_R_CH18.29), CH19 (CN_R_CH19.29), CH20 (CN_R_CH20.29), CH21 (CN_R_CH21.29), CH22 (CN_R_CH22.29)
BUS6: STM32H745 (CN11.62), CH1 (CN_R_CH1.17), CH2 (CN_R_CH2.17), CH3 (CN_R_CH3.17), CH4 (CN_R_CH4.17), CH5 (CN_R_CH5.17), CH6 (CN_R_CH6.17), CH7 (CN_R_CH7.17), CH8 (CN_R_CH8.17), CH9 (CN_R_CH9.17), CH10 (CN_R_CH10.17), CH11 (CN_R_CH11.17), CH12 (CN_R_CH12.17), CH13 (CN_R_CH13.17), CH14 (CN_R_CH14.17), CH15 (CN_R_CH15.17), CH16 (CN_R_CH16.17), CH17 (CN_R_CH17.17), CH18 (CN_R_CH18.17), CH19 (CN_R_CH19.17), CH20 (CN_R_CH20.17), CH21 (CN_R_CH21.17), CH22 (CN_R_CH22.17)
BUS7: STM32H745 (CN12.44), CH1 (CN_L_CH1.21), CH2 (CN_L_CH2.21), CH3 (CN_L_CH3.21), CH4 (CN_L_CH4.21), CH5 (CN_L_CH5.21), CH6 (CN_L_CH6.21), CH7 (CN_L_CH7.21), CH8 (CN_L_CH8.21), CH9 (CN_L_CH9.21), CH10 (CN_L_CH10.21), CH11 (CN_L_CH11.21), CH12 (CN_L_CH12.21), CH13 (CN_L_CH13.21), CH14 (CN_L_CH14.21), CH15 (CN_L_CH15.21), CH16 (CN_L_CH16.21), CH17 (CN_L_CH17.21), CH18 (CN_L_CH18.21), CH19 (CN_L_CH19.21), CH20 (CN_L_CH20.21), CH21 (CN_L_CH21.21), CH22 (CN_L_CH22.21)
BUS_C0: STM32H745 (CN11.57), CH1 (CN_L_CH1.13), CH2 (CN_L_CH2.13), CH3 (CN_L_CH3.13), CH4 (CN_L_CH4.13), CH5 (CN_L_CH5.13), CH6 (CN_L_CH6.13), CH7 (CN_L_CH7.13), CH8 (CN_L_CH8.13), CH9 (CN_L_CH9.13), CH10 (CN_L_CH10.13), CH11 (CN_L_CH11.13), CH12 (CN_L_CH12.13), CH13 (CN_L_CH13.13), CH14 (CN_L_CH14.13), CH15 (CN_L_CH15.13), CH16 (CN_L_CH16.13), CH17 (CN_L_CH17.13), CH18 (CN_L_CH18.13), CH19 (CN_L_CH19.13), CH20 (CN_L_CH20.13), CH21 (CN_L_CH21.13), CH22 (CN_L_CH22.13)
BUS_C1: STM32H745 (CN11.55), CH1 (CN_L_CH1.15), CH2 (CN_L_CH2.15), CH3 (CN_L_CH3.15), CH4 (CN_L_CH4.15), CH5 (CN_L_CH5.15), CH6 (CN_L_CH6.15), CH7 (CN_L_CH7.15), CH8 (CN_L_CH8.15), CH9 (CN_L_CH9.15), CH10 (CN_L_CH10.15), CH11 (CN_L_CH11.15), CH12 (CN_L_CH12.15), CH13 (CN_L_CH13.15), CH14 (CN_L_CH14.15), CH15 (CN_L_CH15.15), CH16 (CN_L_CH16.15), CH17 (CN_L_CH17.15), CH18 (CN_L_CH18.15), CH19 (CN_L_CH19.15), CH20 (CN_L_CH20.15), CH21 (CN_L_CH21.15), CH22 (CN_L_CH22.15)
BUS_C2: STM32H745 (CN11.4), CH1 (CN_L_CH1.17), CH2 (CN_L_CH2.17), CH3 (CN_L_CH3.17), CH4 (CN_L_CH4.17), CH5 (CN_L_CH5.17), CH6 (CN_L_CH6.17), CH7 (CN_L_CH7.17), CH8 (CN_L_CH8.17), CH9 (CN_L_CH9.17), CH10 (CN_L_CH10.17), CH11 (CN_L_CH11.17), CH12 (CN_L_CH12.17), CH13 (CN_L_CH13.17), CH14 (CN_L_CH14.17), CH15 (CN_L_CH15.17), CH16 (CN_L_CH16.17), CH17 (CN_L_CH17.17), CH18 (CN_L_CH18.17), CH19 (CN_L_CH19.17), CH20 (CN_L_CH20.17), CH21 (CN_L_CH21.17), CH22 (CN_L_CH22.17)
CHN_BT0_0: STM32H745 (CN12.45), CH1 (CN_L_CH1.7)
CHN_BT0_1: CH1 (CN_L_CH1.27), CH2 (CN_L_CH2.7)
CHN_BT0_2: CH2 (CN_L_CH2.27), CH3 (CN_L_CH3.7)
CHN_BT0_3: CH3 (CN_L_CH3.27), CH4 (CN_L_CH4.7)
CHN_BT0_4: CH4 (CN_L_CH4.27), CH5 (CN_L_CH5.7)
CHN_BT0_5: CH5 (CN_L_CH5.27), CH6 (CN_L_CH6.7)
CHN_BT0_6: CH6 (CN_L_CH6.27), CH7 (CN_L_CH7.7)
CHN_BT0_7: CH7 (CN_L_CH7.27), CH8 (CN_L_CH8.7)
CHN_BT0_8: CH8 (CN_L_CH8.27), CH9 (CN_L_CH9.7)
CHN_BT0_9: CH9 (CN_L_CH9.27), CH10 (CN_L_CH10.7)
CHN_BT0_10: CH10 (CN_L_CH10.27), CH11 (CN_L_CH11.7)
CHN_BT0_11: CH11 (CN_L_CH11.27), CH12 (CN_L_CH12.7)
CHN_BT0_12: CH12 (CN_L_CH12.27), CH13 (CN_L_CH13.7)
CHN_BT0_13: CH13 (CN_L_CH13.27), CH14 (CN_L_CH14.7)
CHN_BT0_14: CH14 (CN_L_CH14.27), CH15 (CN_L_CH15.7)
CHN_BT0_15: CH15 (CN_L_CH15.27), CH16 (CN_L_CH16.7)
CHN_BT0_16: CH16 (CN_L_CH16.27), CH17 (CN_L_CH17.7)
CHN_BT0_17: CH17 (CN_L_CH17.27), CH18 (CN_L_CH18.7)
CHN_BT0_18: CH18 (CN_L_CH18.27), CH19 (CN_L_CH19.7)
CHN_BT0_19: CH19 (CN_L_CH19.27), CH20 (CN_L_CH20.7)
CHN_BT0_20: CH20 (CN_L_CH20.27), CH21 (CN_L_CH21.7)
CHN_BT0_21: CH21 (CN_L_CH21.27), CH22 (CN_L_CH22.7)
CHN_IN_RST: STM32H745 (CN12.43), CH1 (CN_L_CH1.14 CN_L_CH1.25)
I2C2_SCL: STM32H745 (CN12.17), CH1 (CN_R_CH1.25), CH2 (CN_R_CH2.25), CH3 (CN_R_CH3.25), CH4 (CN_R_CH4.25), CH5 (CN_R_CH5.25), CH6 (CN_R_CH6.25), CH7 (CN_R_CH7.25), CH8 (CN_R_CH8.25), CH9 (CN_R_CH9.25), CH10 (CN_R_CH10.25), CH11 (CN_R_CH11.25), CH12 (CN_R_CH12.25), CH13 (CN_R_CH13.25), CH14 (CN_R_CH14.25), CH15 (CN_R_CH15.25), CH16 (CN_R_CH16.25), CH17 (CN_R_CH17.25), CH18 (CN_R_CH18.25), CH19 (CN_R_CH19.25), CH20 (CN_R_CH20.25), CH21 (CN_R_CH21.25), CH22 (CN_R_CH22.25)
I2C2_SDA: STM32H745 (CN11.21), CH1 (CN_R_CH1.18), CH2 (CN_R_CH2.18), CH3 (CN_R_CH3.18), CH4 (CN_R_CH4.18), CH5 (CN_R_CH5.18), CH6 (CN_R_CH6.18), CH7 (CN_R_CH7.18), CH8 (CN_R_CH8.18), CH9 (CN_R_CH9.18), CH10 (CN_R_CH10.18), CH11 (CN_R_CH11.18), CH12 (CN_R_CH12.18), CH13 (CN_R_CH13.18), CH14 (CN_R_CH14.18), CH15 (CN_R_CH15.18), CH16 (CN_R_CH16.18), CH17 (CN_R_CH17.18), CH18 (CN_R_CH18.18), CH19 (CN_R_CH19.18), CH20 (CN_R_CH20.18), CH21 (CN_R_CH21.18), CH22 (CN_R_CH22.18)
PROGRAMMER_RX: STM32H745 (CN11.9), CH1 (CN_R_CH1.21), CH2 (CN_R_CH2.21), CH3 (CN_R_CH3.21), CH4 (CN_R_CH4.21), CH5 (CN_R_CH5.21), CH6 (CN_R_CH6.21), CH7 (CN_R_CH7.21), CH8 (CN_R_CH8.21), CH9 (CN_R_CH9.21), CH10 (CN_R_CH10.21), CH11 (CN_R_CH11.21), CH12 (CN_R_CH12.21), CH13 (CN_R_CH13.21), CH14 (CN_R_CH14.21), CH15 (CN_R_CH15.21), CH16 (CN_R_CH16.21), CH17 (CN_R_CH17.21), CH18 (CN_R_CH18.21), CH19 (CN_R_CH19.21), CH20 (CN_R_CH20.21), CH21 (CN_R_CH21.21), CH22 (CN_R_CH22.21)
PROGRAMMER_TX: STM32H745 (CN11.11), CH1 (CN_R_CH1.33), CH2 (CN_R_CH2.33), CH3 (CN_R_CH3.33), CH4 (CN_R_CH4.33), CH5 (CN_R_CH5.33), CH6 (CN_R_CH6.33), CH7 (CN_R_CH7.33), CH8 (CN_R_CH8.33), CH9 (CN_R_CH9.33), CH10 (CN_R_CH10.33), CH11 (CN_R_CH11.33), CH12 (CN_R_CH12.33), CH13 (CN_R_CH13.33), CH14 (CN_R_CH14.33), CH15 (CN_R_CH15.33), CH16 (CN_R_CH16.33), CH17 (CN_R_CH17.33), CH18 (CN_R_CH18.33), CH19 (CN_R_CH19.33), CH20 (CN_R_CH20.33), CH21 (CN_R_CH21.33), CH22 (CN_R_CH22.33)
TIMER_SYNC_0: STM32H745 (CN12.4), CH1 (CN_L_CH1.30), CH2 (CN_L_CH2.30), CH3 (CN_L_CH3.30), CH4 (CN_L_CH4.30), CH5 (CN_L_CH5.30), CH6 (CN_L_CH6.30), CH7 (CN_L_CH7.30), CH8 (CN_L_CH8.30), CH9 (CN_L_CH9.30), CH10 (CN_L_CH10.30), CH11 (CN_L_CH11.30), CH12 (CN_L_CH12.30), CH13 (CN_L_CH13.30), CH14 (CN_L_CH14.30), CH15 (CN_L_CH15.30), CH16 (CN_L_CH16.30), CH17 (CN_L_CH17.30), CH18 (CN_L_CH18.30), CH19 (CN_L_CH19.30), CH20 (CN_L_CH20.30), CH21 (CN_L_CH21.30), CH22 (CN_L_CH22.30)
TIMER_SYNC_1: STM32H745 (CN12.19), CH1 (CN_L_CH1.28), CH2 (CN_L_CH2.28), CH3 (CN_L_CH3.28), CH4 (CN_L_CH4.28), CH5 (CN_L_CH5.28), CH6 (CN_L_CH6.28), CH7 (CN_L_CH7.28), CH8 (CN_L_CH8.28), CH9 (CN_L_CH9.28), CH10 (CN_L_CH10.28), CH11 (CN_L_CH11.28), CH12 (CN_L_CH12.28), CH13 (CN_L_CH13.28), CH14 (CN_L_CH14.28), CH15 (CN_L_CH15.28), CH16 (CN_L_CH16.28), CH17 (CN_L_CH17.28), CH18 (CN_L_CH18.28), CH19 (CN_L_CH19.28), CH20 (CN_L_CH20.28), CH21 (CN_L_CH21.28), CH22 (CN_L_CH22.28)